# Altium schematic sheet Schema_rechtsonder.SchDoc
size A4; SheetNumber: 1; SheetTotal: 2
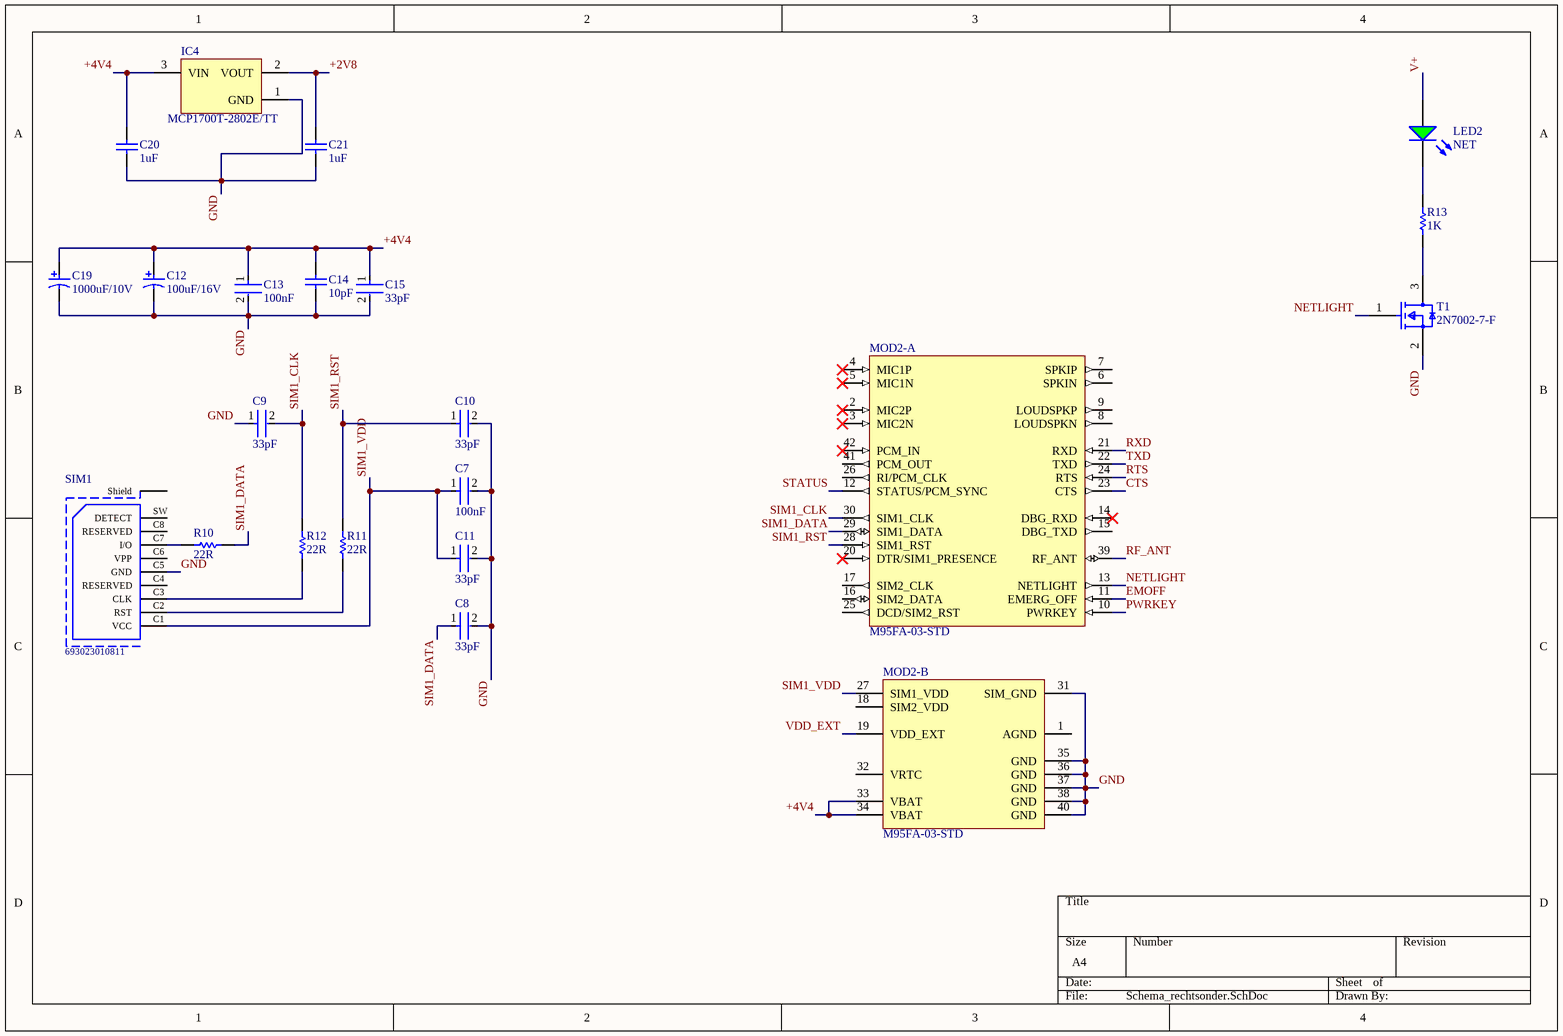
[diagram p0: Schema_rechtsonder.SchDoc]

## Parts
C7  100nF  [FP-CC1206-1_25-MFG]
C8  33pF  [FP-C0805C-DN-MFG]
C9  33pF  [FP-C0805C-DN-MFG]
C10  33pF  [FP-C0805C-DN-MFG]
C11  33pF  [FP-C0805C-DN-MFG]
C12  100uF/16V  [AVX-TAJ-C-2_M]
C13  100nF  [FP-CC1206-1_25-MFG]
C14  10pF  [CAPC2013X145X50ML20T20]
C15  33pF  [FP-C0805C-DN-MFG]
C19  1000uF/10V  [NIC-CAPA2-10X10_V]
C20  1uF  [CAPC1206(3216)130_M]
C21  1uF  [CAPC1206(3216)130_M]
IC4  MCP1700T-2802E/TT  [SOT-23-TT3_M]
LED2  NET  [LUMX-SML-LX1206GC-TR_V]
MOD2-  M95FA-03-STD  [QUEC-M95FA-03-STD_V]  (parts A,B of 2)
R10  22R  [RESC3225X60X45ML20T20]
R11  22R  [RESC3225X60X45ML20T20]
R12  22R  [RESC3225X60X45ML20T20]
R13  1K  [RESC3225X60X45ML20T20]
SIM1  693023010811  [693023010811]
T1  2N7002-7-F  [FP-SOT23-MFG]

## Nets
+2V8: C21.2 IC4.2(VOUT)
+4V4: C12.1 C13.1 C14.2 C15.1 C19.1 C20.2 IC4.3(VIN) MOD2-.33(VBAT) MOD2-.34(VBAT)
CTS: MOD2-.23(CTS)
EMOFF: MOD2-.11(EMERG_OFF)
GND: C7.2 C8.2 C9.1 C10.2 C11.2 C12.2 C13.2 C14.1 C15.2 C19.2 C20.1 C21.1 IC4.1(GND) MOD2-.31(SIM_GND) MOD2-.35(GND) MOD2-.36(GND) MOD2-.37(GND) MOD2-.38(GND) MOD2-.40(GND) SIM1.C5(GND) T1.2(S)
NETLIGHT: MOD2-.13(NETLIGHT) T1.1(G)
PWRKEY: MOD2-.10(PWRKEY)
RF_ANT: MOD2-.39(RF_ANT)
RTS: MOD2-.24(RTS)
RXD: MOD2-.21(RXD)
SIM1_CLK: C9.2 MOD2-.30(SIM1_CLK) R12.2
SIM1_DATA: C8.1 MOD2-.29(SIM1_DATA) R10.1
SIM1_RST: C10.1 MOD2-.28(SIM1_RST) R11.2
SIM1_VDD: C7.1 C11.1 MOD2-.27(SIM1_VDD) SIM1.C1(VCC)
STATUS: MOD2-.12(STATUS/PCM_SYNC)
TXD: MOD2-.22(TXD)
V+: LED2.1(A)
VDD_EXT: MOD2-.19(VDD_EXT)
NetLED2_2: LED2.2(K) R13.2
NetR10_2: R10.2 SIM1.C7(I/O)
NetR11_1: R11.1 SIM1.C2(RST)
NetR12_1: R12.1 SIM1.C3(CLK)
NetR13_1: R13.1 T1.3(D)

Not connected (* = marked no-connect by the designer): MOD2- 1(AGND) 2(MIC2P)* 3(MIC2N)* 4(MIC1P)* 5(MIC1N)* 6(SPKIN) 7(SPKIP) 8(LOUDSPKN) 9(LOUDSPKP) 14(DBG_RXD)* 15(DBG_TXD) 16(SIM2_DATA) 17(SIM2_CLK) 18(SIM2_VDD) 20(DTR/SIM1_PRESENCE)* 25(DCD/SIM2_RST) 26(RI/PCM_CLK) 32(VRTC) 41(PCM_OUT) 42(PCM_IN)*; SIM1 C4(RESERVED) C6(VPP) C8(RESERVED) Shield SW(DETECT)

## Library data of the parts
C7 C13 = CMP-03422-000842-1: CAP CER 0.1UF 50V X7R 1206; Manufacturer: Yageo; Manufacturer Part Number: CC1206KRX7R9BB104; Automotive Grade: NA; Tolerance: 0.1; Material: Ceramic; Temperature Coefficient: 15%; Temperature Characteristic: X7R; Device Class L1: Passive Components; Lead Free: Yes; Octopart: https://octopart.com/cc1206krx7r9bb104-yageo-39467816; Category: Cap; Value: 100 nF; Temperature Range Low: -55°C; Device Class L3: Ceramic Capacitors; Voltage Rating: 50 V; Temperature Range High: +125°C; Device Class L2: Capacitors; RoHS: TRUE; Package: CC1206-1.25; Footprint Url: http://www.yageo.com/exep/pages/download/literatures/UPY-C_GEN_24.pdf; ComponentLink2Description: Datasheet; Temperature: -55°C to +125°C; Capacitance: 100 nF; Digikey Description: CAP CER 0.1UF 50V X7R 1206; Height: 1.45mm; Automotive: No; Mouser Description: Multilayer Ceramic Capacitors MLCC - SMD/SMT 100nF 50V X7R 10%; ComponentLink2URL: http://www.yageo.com/documents/recent/UPY-NP0X7R_HV_1KV-to-3KV_11.pdf
C8-C11 C15 = CMP-2007-00359-2: CAP CER 33PF 50V 1% NP0 0805; Manufacturer Part Number: C0805C330F5GACTU; Manufacturer: KEMET; Material: Ceramic; Temperature Characteristic: C0G; Tolerance: 0.01; Temperature Coefficient: 30ppm/°C; ComponentLink2Description: Datasheet; Height: 0.88mm; Device Class L1: Passive Components; Temperature: -55°C to +125°C; ComponentLink2URL: https://content.kemet.com/datasheets/KEM_C1003_C0G_SMD.pdf; Device Class L2: Capacitors; Mouser Description: Mlcc Capacitor, 33Pf, 50V, C0G, 1%, 0805, Full Reel; Octopart: https://octopart.com/c0805c330f5gactu-kemet-9138632; Device Class L3: Ceramic Capacitors; Lead Free: Yes; RoHS: TRUE; Category: Cap; Package: C0805C-DN; Value: 33 pF; Voltage Rating: 50 V; Temperature Range High: +125°C; Ipc Land Pattern Name: CAPC200125X78; Digikey Description: CAP CER 33PF 50V 1% NP0 0805; Automotive: No; Temperature Range Low: -55°C; Capacitance: 33 pF
C12 = CMP-2100-03691-1: Standard Tantalum, 100 uF, +/- 10%, 16 V, -55 to 125 degC, 2-Pin SMD (2312), RoHS, Tape and Reel; Manufacturer: AVX; Resistance: 1Ohm; Dissipation Factor: 8%; Voltage Rating: 16V; Polarity: Polar; Capacitance: 100uF; Leakage Current: 16uA; Datasheet URL: http://datasheets.avx.com/TAJ.pdf; Package Description: 2-Pin Surface Mount Device, Body 6 x 3.25 mm; Case/Package: Molded; Case Code (Metric): 6032; Number of Pins: 2; Tolerance: 10%; Length: 6mm; Width: 3.2mm; Height: 2.8mm; Height - Seated (Max): 0.11inch; Min Operating Temperature: -55degC; Termination: SMD/SMT; Voltage Rating (DC): 16V; Max Operating Temperature: 125degC; Package Quantity: 1; Manufacturer URL: http://www.avx.com/; RoHSCompliant: True; ESR (Equivalent Series Resistance): 1Ohm; Packaging: TapeandReel; Radiation Hardening: No; Lead Free: LeadFree; Case Code (Imperial): 2412; Depth: 3.2mm; Datasheet Version: 42401.0; Package Reference: TAJ-C-2; REACH SVHC: NoSVHC
C14 = CMP-1036-00854-2: Manufacturer: Vitramon; Part Number: VJ0805A100FXACW1BC
C19 = CMP-0687-00006-1: Aluminum Electrolytic Capacitor, UD Series, Low Impedance, 1000 uF, 10 V, + / - 20%, -55 to 105 degC, Chip Type, 10 x 10 mm D x L, Pb-Free, Reel; Manufacturer: Nichicon; PartNumber: UUD1A102MNL1GS; Rated Voltage: 10 V; Rated Capacitance: 1000 uF; Endurance Time: 5000 h; Impedance: 0.09 Ohm; Packing: Dia382mm Reel; Tolerance Rated Capacitance: -20 to 20%; Rated Ripple Current (at 100kHz): 670 mA; DatasheetVersion: 08/2012; PackageReference: CAPAE-D10H10; PackageDescription: 2-Pin Surface Mount Device, Diameter 10 mm, Height 10 mm, Pitch 8 mm; ComponentLink3URL: http://products.nichicon.co.jp/en/pdf/XJA043/e-ud.pdf; ComponentLink2Description: Datasheet; Diameter: 10 mm; ComponentLink1Description: Manufacturer URL; RoHS: TRUE; ComponentLink2URL: http://products.nichicon.co.jp/en/pdf/XJA043/e-ud.pdf; Length: 10 mm; ComponentLink1URL: http://www.nichicon.co.jp/; Mounting Technology: Surface Mount; ComponentLink3Description: Package Specification
C20 C21 = CMP-1037-04673-1: CAP 1uF 10V ±10% 1206 (3216 Metric) Thickness 1.3mm SMD; Tolerance: Â±10%; Case-Metric: 3216; Case-EIA: 1206; Max Thickness: 1.3 mm; Technology: SMT; Rated Voltage: 10 V; Value: 1uF
IC4 = CMP-0136-00770-1: Low Quiescent Current LDO, 3-Pin SOT-23, Extended Temperature, Tape and Reel; DatasheetVersion: revB, Feb-2007; PackageDescription: 3-Lead Plastic Small Outline Transistor (TT) [SOT-23]; PackageVersion: revBB, Aug-2009; PackageReference: SOT-23-TT3; Code_IPC: SOT23-3
LED2 = CMP-2000-07122-1: Green Led, Water Clear Lens, 10 mcd, 565 nm, 2.2 V, -40 to 85 degC, 2-Pin SMD, RoHS, Tape and Reel; Part No: SML-LX1206GC-TR; Manufacturer: Lumex; Number of LEDs: 1; Type: Uni-Color; Viewing Angle: 160; Pin_Count: 2; Intensity: 10mcd; Reverse Voltage: 5(Min)V; COO: CN; LED Material: GaP; Peak Wavelength: 565nm; Lens Appearance: ColorlessNonDiffused; Datasheet Version: Rev. J, 04/2011; Package Description: 2-Pin Surface Mount Device, Body 3.2 x 1.6 mm; Lens Dimensions: 2x1.6x0.5mm; Dimension: 3.2x1.6x1.1mm; Color: Green; Supplier: Lumex; Supplier Standard Pack: 3,000; Manufacturer URL: http://www.lumexinstruments.com/; Dominant Wavelength: N/A; ECCN: EAR99; Datasheet URL: http://www.mouser.com/ds/2/244/SML-LX1206GC-TR-112732.pdf; HTS: 8541402000; Mounting: SurfaceMount; Package Reference: SML-LX1206GC-TR; Family: SML-LX1206GC; Packaging: TapeandReel; RoHS: Yes; Operating Temperature: -40to85C; Supplier_Package: SMD; Mounting Technology: SurfaceMount
MOD2- = CMP-2000-06650-1: Quad-Band GSM / GPRS Module, 850 / 900 / 1800 / 1900 MHz, 3.3 to 4.6 V, -40 to 85 degC, 42-Pin SMD, RoHS, Tape and Reel; Manufacturer: QUECTELWIRELESSSOLUTIONS; Manufacturer URL: http://www.quectel.com/; Datasheet Version: Rev. 3.1, 11/2014; Package Reference: M95FA-03-STD; Package Description: 42-Pin Sourface Mount Device, Body 23.6 x 19.9 mm; Package: 42LCC; Category: RFModulesMisc; Mounting Technology: SurfaceMount; Operating Temperature: -40to85°C; Datasheet URL: https://www.codico.com/shop/media/datasheets/Quectel_M95_Hardware_Design_V3.1.pdf
R10-R13 = CMP-2005-02079-1: Manufacturer: Vishay Dale; Part Number: CRCW121024R9FKEA
SIM1 = CMP-1502-00158-1: WR-CRD Micro SIM Card Connector, Push & Pull, with Card Detection; Manufacturer: Wurth Elektronik; Withstanding Voltage: 500VAC; Rated Current: 1A; Working Voltage: 30VAC; Datasheet URL: https://katalog.we-online.de/em/datasheet/693023010811.pdf; Publisher: WurthElektronik; Mounting Technology: SMT; Operating Temperature: -25to85degC; Packaging: TapeandReel; Package Reference: 693023010811; Part Number: 693023010811; Manufacturer URL: http://www.we-online.de
T1 = CMP-2000-04929-2: MOSFET N-CH 60V 115MA SOT23-3; Turn-On Delay Time: 7ns; Turn-Off Delay Time: 11ns; Drain to Source Resistance: 7.5R; Rise Time: 3ns; Drain to Source Breakdown Voltage: 70V; Input Capacitance: 50pF; Number of Elements: 1; Power Dissipation: 540mW; Max Power Dissipation: 300mW; Fall Time: 5.6ns; Gate to Source Voltage (Vgs): 20V; Threshold Voltage: 2.5V; Element Configuration: Single; Termination: SMD/SMT; Weight: 0.000282oz; Radiation Hardening: No; Max Operating Temperature: 150°C; On-State Resistance: 7.5R; Mount: Surface Mount; Current Rating: 115mA; Contact Plating: Tin; Lead Free: Lead Free; Min Operating Temperature: -55°C; Number of Pins: 3; REACH SVHC: No SVHC; Drain to Source Voltage (Vdss): 60V; Width: 1.3mm; Package Quantity: 3000; Length: 2.9mm; Case/Package: SOT-23; Number of Channels: 1; Dual Supply Voltage: 60V; Packaging: Tape and Reel; Height: 1mm; Voltage Rating (DC): 60V; Nominal Vgs: 2.5V; Continuous Drain Current (ID): 115mA; Voltage: 60V; Rds On Max: 7.5R